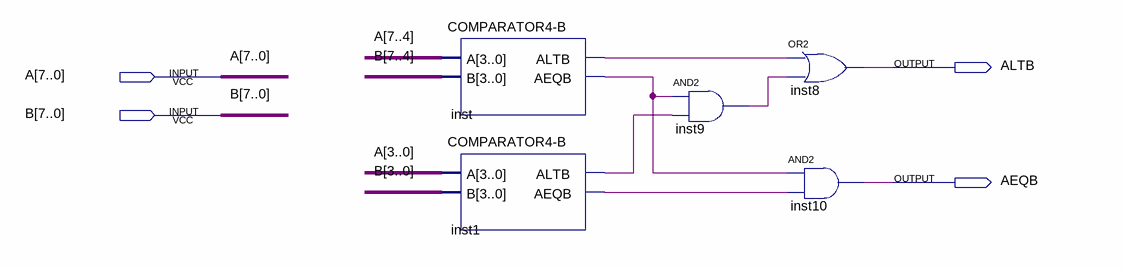
[diagram p0: schematic sheet]
// Quartus schematic COMPARATOR8-B.bdf as structural Verilog: 5 symbols, 4 pins
module \COMPARATOR8-B  (
  input  [7:0] A,
  input  [7:0] B,
  output ALTB,
  output AEQB
);

  wire inst1_aeqb, inst1_altb, inst9_out, inst_aeqb, inst_altb;

  \COMPARATOR4-B  inst (.A(A[7:4]), .B(B[7:4]), .ALTB(inst_altb), .AEQB(inst_aeqb));
  \COMPARATOR4-B  inst1 (.A(A[3:0]), .B(B[3:0]), .ALTB(inst1_altb), .AEQB(inst1_aeqb));
  and inst9 (inst9_out, inst_aeqb, inst1_altb);
  or inst8 (ALTB, inst_altb, inst9_out);
  and inst10 (AEQB, inst_aeqb, inst1_aeqb);
endmodule
